# EAGLE design ctia (EAGLE 7.2.0)
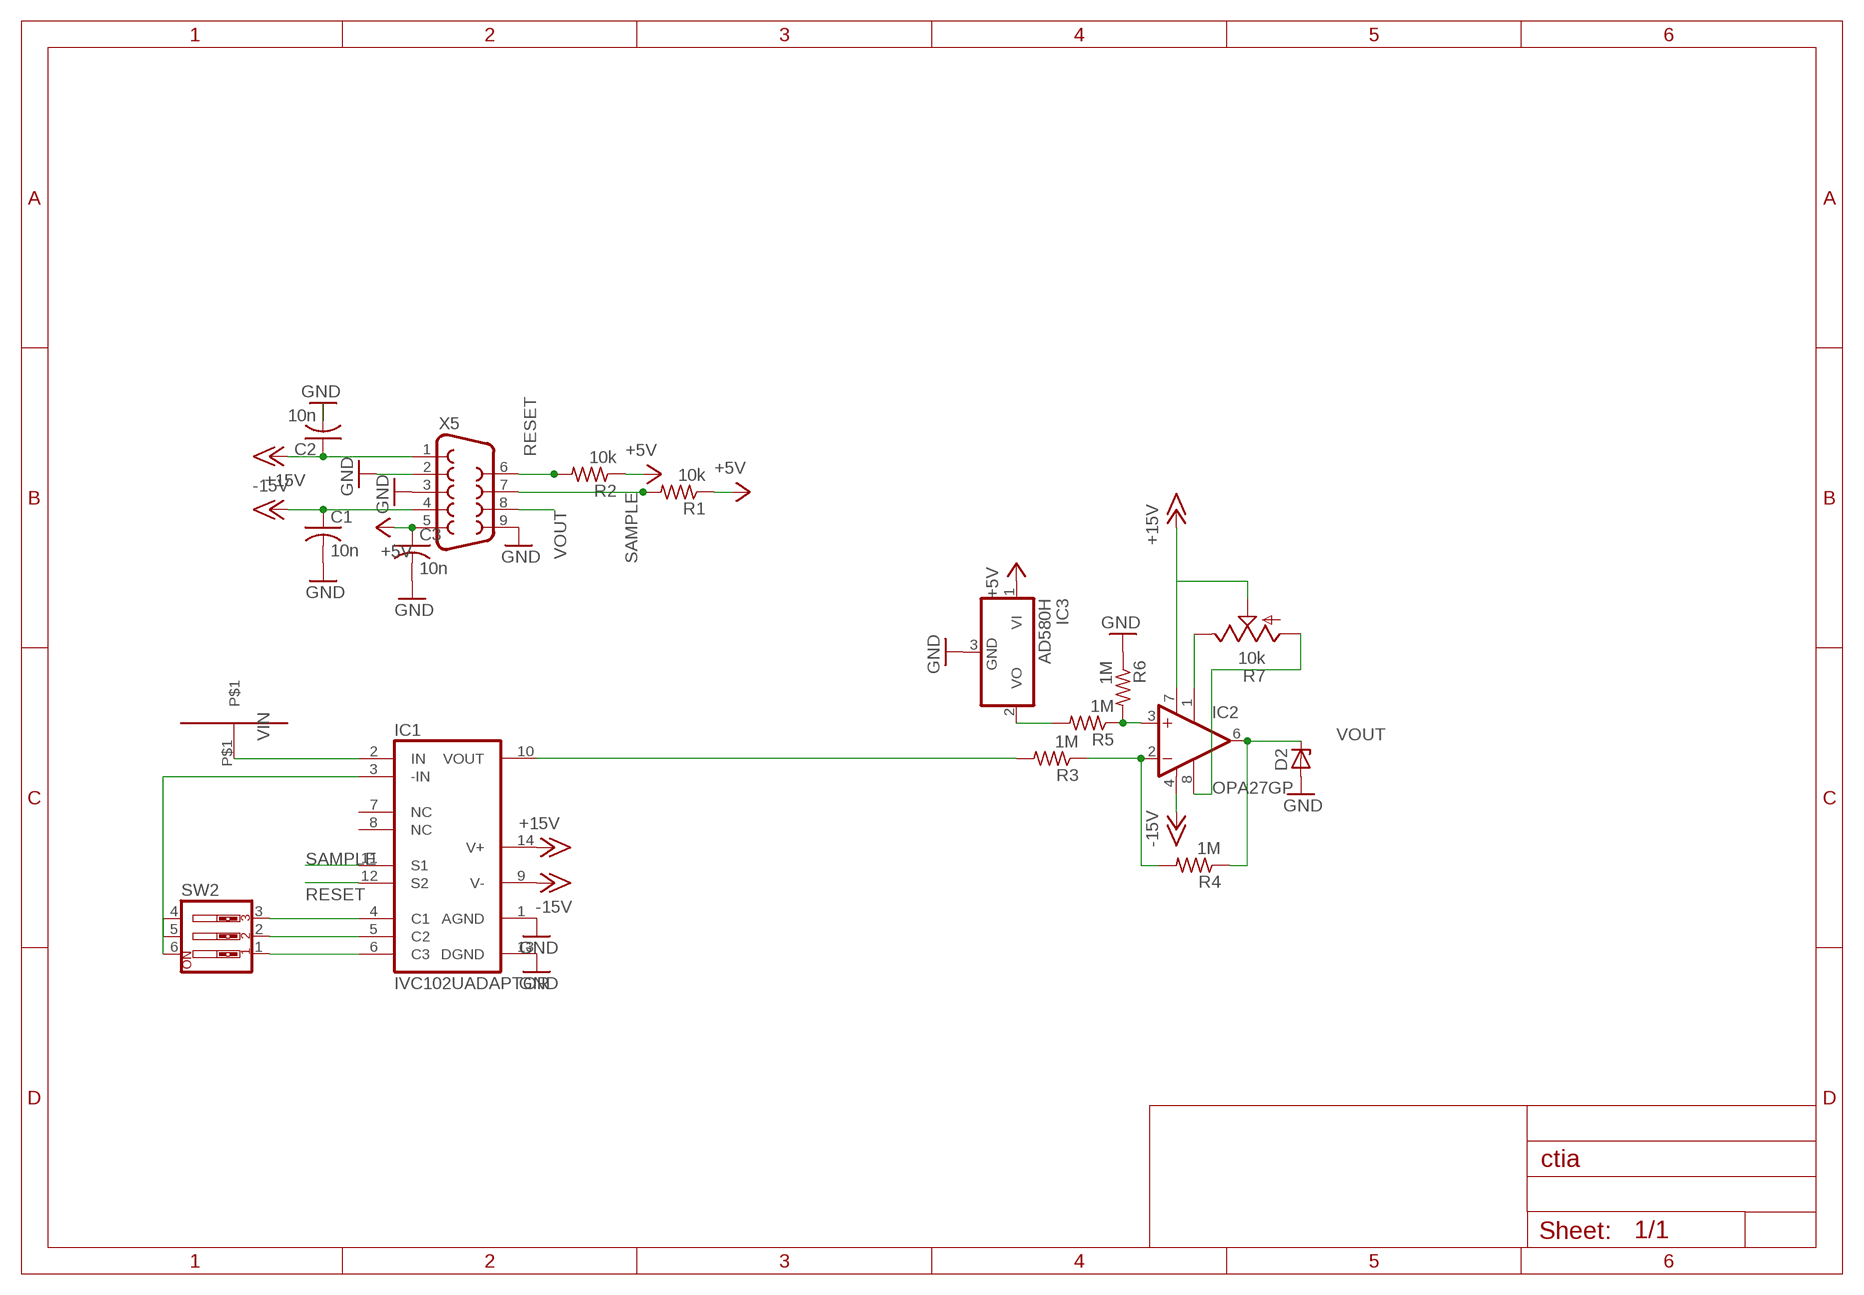
[diagram p0: schematic, sheet 1]

## Parts
C1  10n  C-US050-050X075  [C050-050X075]
C2  10n  C-US050-050X075  [C050-050X075]
C3  10n  C-US050-050X075  [C050-050X075]
D2  ZENER-DIODEDO41Z10  [DO41Z10]
IC1  IVC102UADAPTOR  [DIL14]
IC2  OPA27GP  [DIL08]
IC3  AD580H  [TO39]
R1  10k  R-US_0207/15  [0207/15]
R2  10k  R-US_0207/15  [0207/15]
R3  1M  R-US_0207/10  [0207/10]
R4  1M  R-US_0207/10  [0207/10]
R5  1M  R-US_0207/10  [0207/10]
R6  1M  R-US_0207/10  [0207/10]
R7  10k  TRIM_US-B64Y  [B64Y]
SW2  SW_DIP-3  [EDG-03]
U$1  CTIA  [CTIA]
X5  F09HP  [F09HP]

## Nets
+5V: C3.1 IC3.1(VI) R1.1 R2.1 X5.5
+15V: C2.1 IC1.14(V+) IC2.7(V+) R7.S X5.1
-15V: C1.1 IC1.9(V-) IC2.4(V-) X5.4
GND: C1.2 C2.2 C3.2 D2.A IC1.1(AGND) IC1.13(DGND) IC3.3(GND) R6.1 X5.2 X5.3 X5.9
N$1: IC1.6(C3) SW2.1
N$2: IC1.5(C2) SW2.2
N$3: IC1.4(C1) SW2.3
N$4: IC1.3(-IN) SW2.4 SW2.5 SW2.6
N$5: IC1.10(VOUT) R3.2
N$6: IC2.2(-IN) R3.1 R4.2
N$7: IC2.3(+IN) R5.1 R6.2
N$8: IC3.2(VO) R5.2
N$9: IC2.1(OFF1) R7.E
N$10: IC2.8(OFF2) R7.A
RESET: IC1.12(S2) R2.2 X5.6
SAMPLE: IC1.11(S1) R1.2 X5.7
VIN: IC1.2(IN) U$1.P$1
VOUT: D2.C IC2.6(OUT) R4.1 X5.8
Unconnected: IC1.7(NC) IC1.8(NC)

## Library data of the parts
C1-C3 = rcl:C-US: CAPACITOR, American symbol
D2 = diode:ZENER-DIODE: Z-Diode
IC1 = burr-brown:IVC102U: Amplifier Precision Switched Integrator Transimpedance
IC2 = linear:OPA*?: Ultra-Low Noise, Precision OP AMP Source: http://focus.ti.com/lit/ds/symlink/opa27.pdf http://focus.ti.com .. opa241.pdf
IC3 = linear:AD580H: VOLTAGE REFERENCE 2.5 V
R1-R6 = resistor:R-US_: RESISTOR, American symbol
R7 = pot:TRIM_US-: POTENTIOMETER
SW2 = special:SW_DIP-3: DIP SWITCH
U$1 = ctia:CTIA
X5 = con-subd:F09: SUB-D; OC_FARNELL: unknown; OC_NEWARK: unknown

## Board
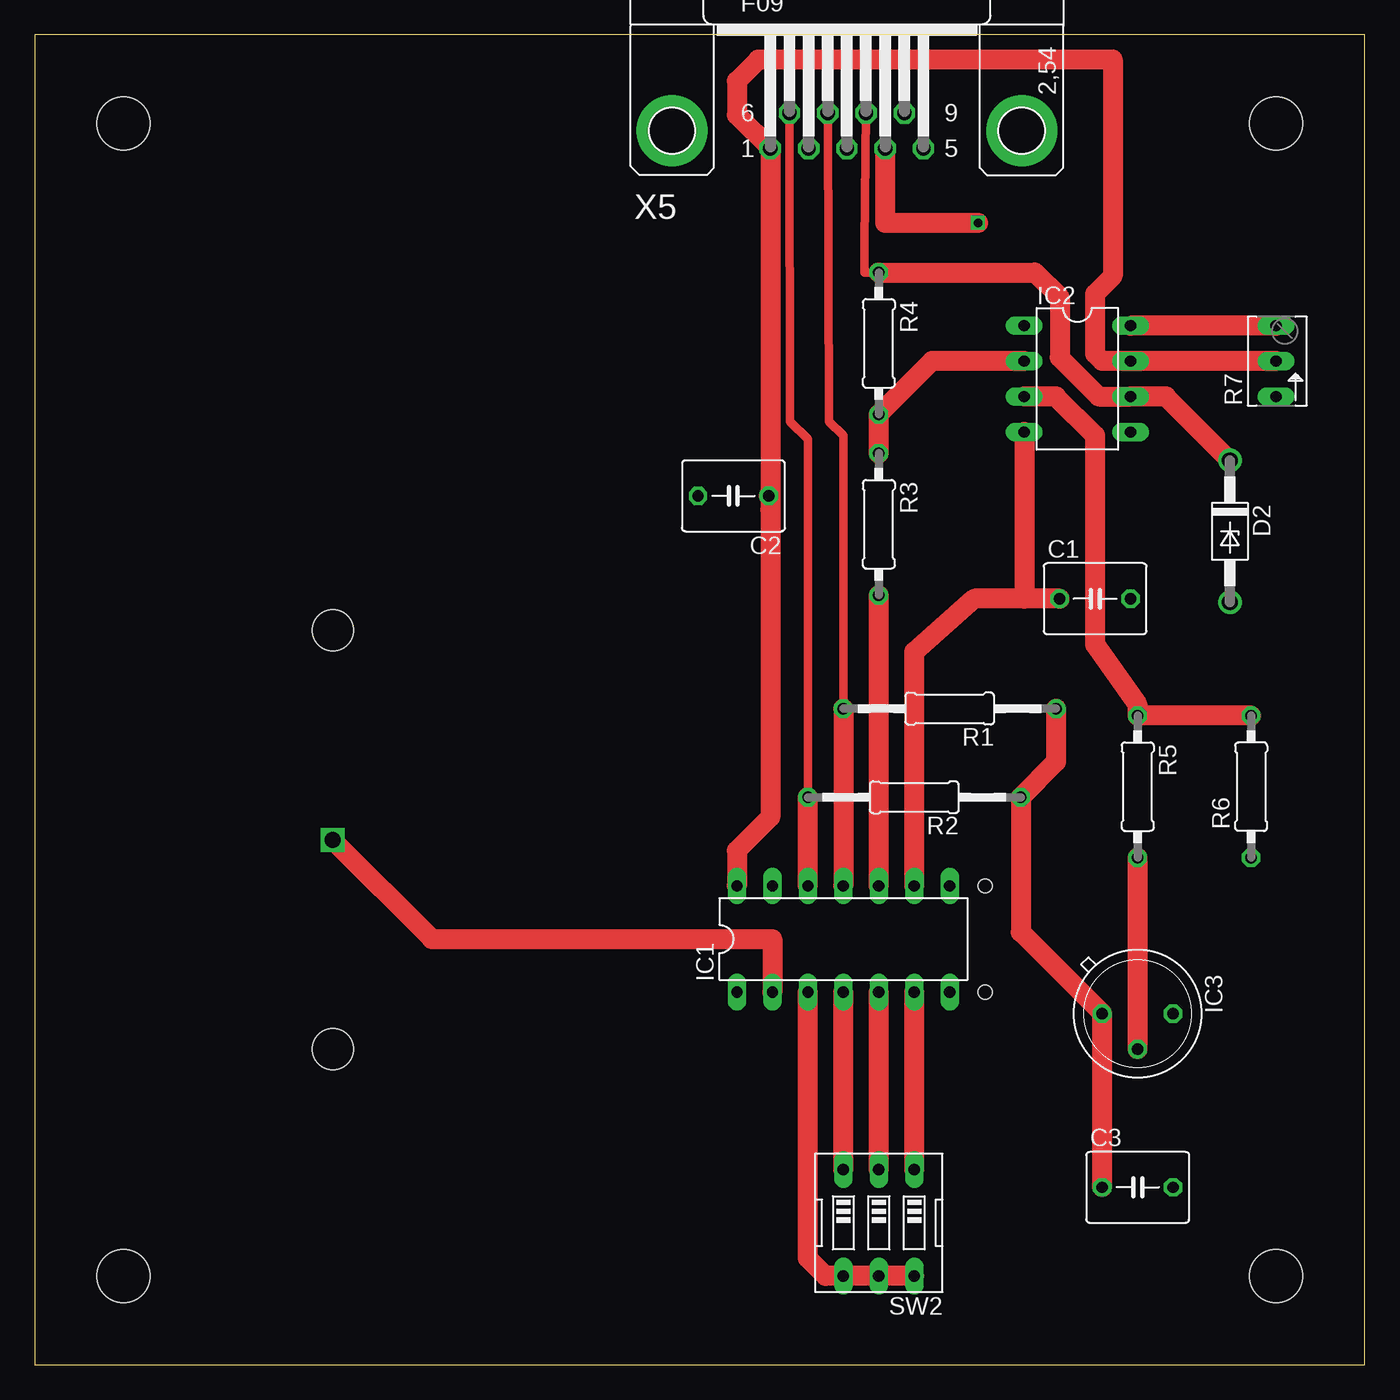
[diagram p1: board, top side]
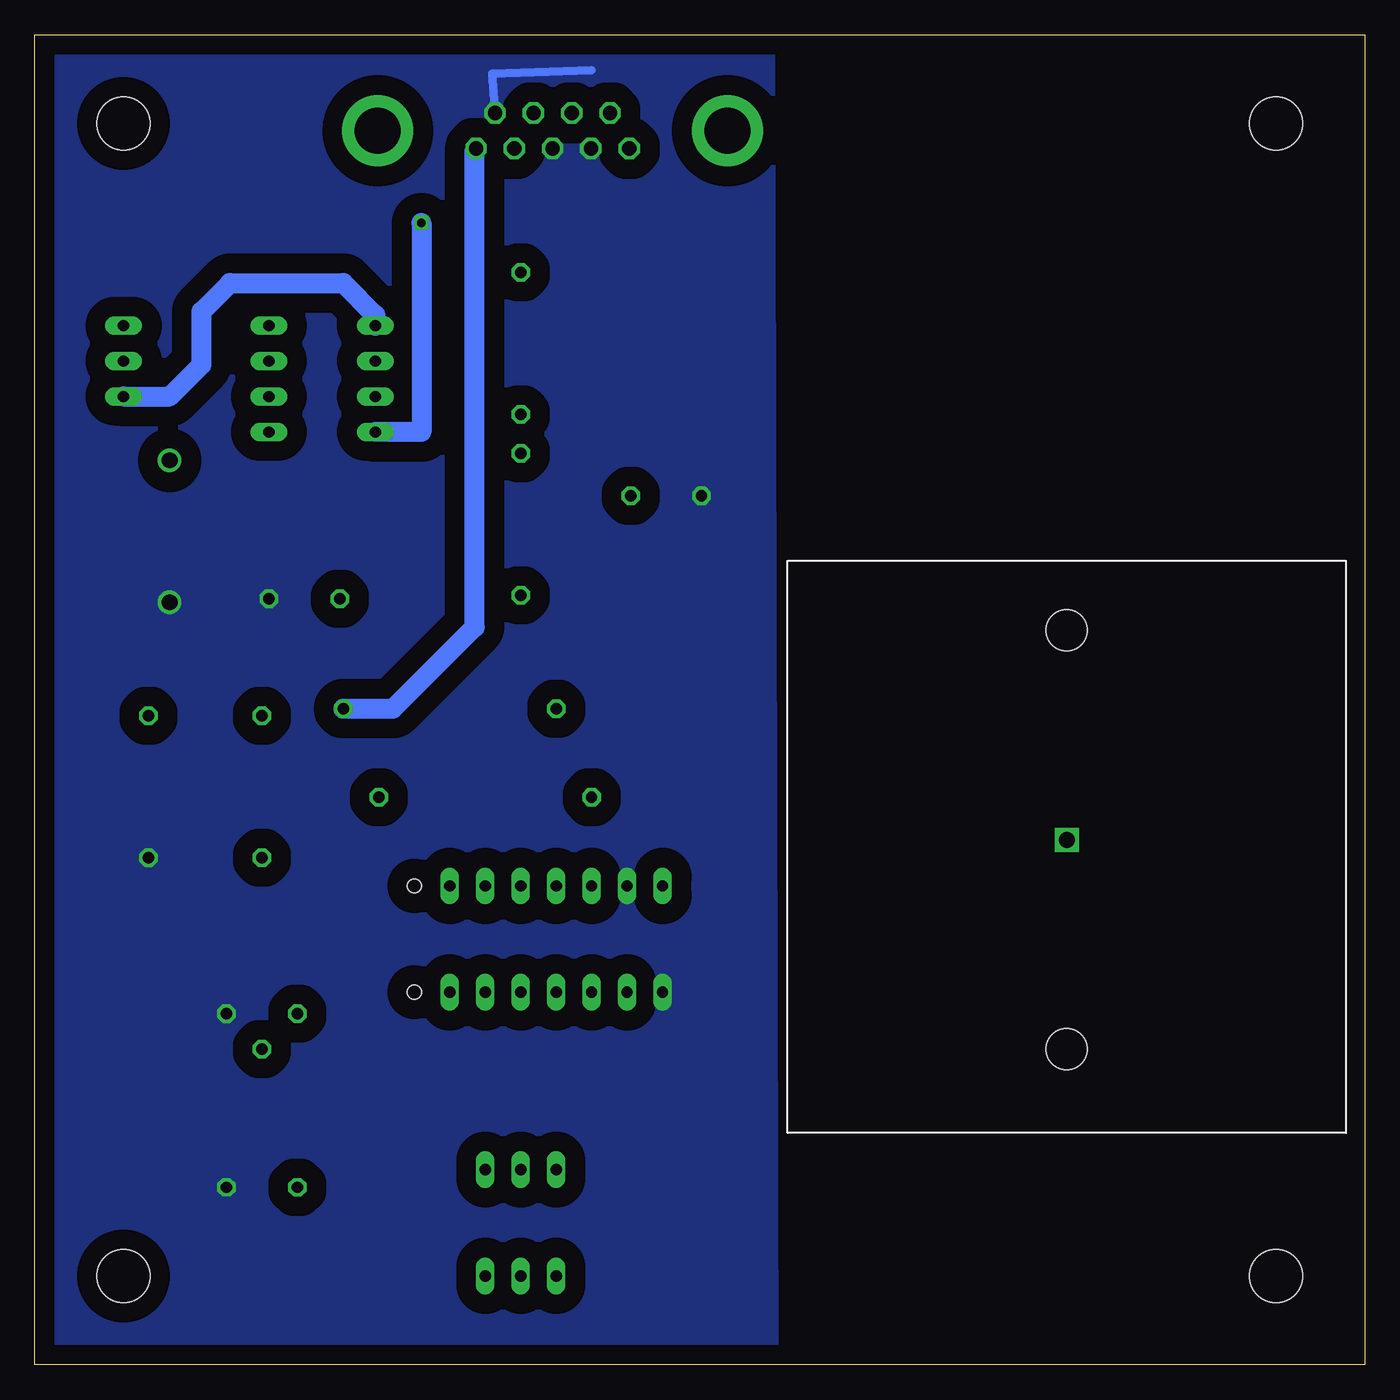
[diagram p2: board, bottom side, seen from below]

Size 95.25 x 95.25 mm. Coordinates in mm from the lower left corner, seen from the top.
Outline: 0,0 95.25,0 95.25,95.25 0,95.25 0,0
Copper layers (1*16): Top 0.035mm / dielectric 1.5mm / Bottom 0.035mm
Design rules "default": minimum track width 10mil, minimum drill 24mil, track to track 8mil, track to pad 8mil, pad to pad 8mil, via to via 8mil, smd to smd 8mil, copper to edge 40mil, drill to drill 8mil, minimum pad ring 10mil, minimum via ring 8mil, stop-mask expansion 4mil, vias tented up to drill 0mil, thermal gap 10mil
Holes 1 mm at 68.07,34.29 68.07,26.67
Holes 3.8 mm at 6.35,88.9 88.9,88.9 88.9,6.35 6.35,6.35

### Footprints (pad centres in the part's own frame; a part is rotated, then mirrored left to right if it is on the bottom)
C050-050X075 = drill 0.813 octagon: 1 -2.54,0; 2 2.54,0
DO41Z10 = drill 1.118: A 5.08,0; C -5.08,0
DIL14 = drill 0.813 long: 1 -7.62,-3.81; 2 -5.08,-3.81; 3 -2.54,-3.81; 4 0,-3.81; 5 2.54,-3.81; 6 5.08,-3.81; 7 7.62,-3.81; 8 7.62,3.81; 9 5.08,3.81; 10 2.54,3.81; 11 0,3.81; 12 -2.54,3.81; 13 -5.08,3.81; 14 -7.62,3.81
DIL08 = drill 0.813 long: 1 -3.81,-3.81; 2 -1.27,-3.81; 3 1.27,-3.81; 4 3.81,-3.81; 5 3.81,3.81; 6 1.27,3.81; 7 -1.27,3.81; 8 -3.81,3.81
TO39 = drill 0.813 octagon: 1 0,-2.54; 2 2.54,0; 3 0,2.54
0207/15 = drill 0.813 octagon: 1 -7.62,0; 2 7.62,0
0207/10 = drill 0.813 octagon: 1 -5.08,0; 2 5.08,0
B64Y = drill 0.813 long: A 2.54,0; E -2.54,0; S 0,0
EDG-03 = drill 0.813 long: 1 -2.54,-3.81; 2 0,-3.81; 3 2.54,-3.81; 4 2.54,3.81; 5 0,3.81; 6 -2.54,3.81
CTIA = drill 1.143 square: P$1 0,0 | hole 2.946: 14.999,0; -14.999,0
F09HP = drill 1.016 octagon: 1 -5.486,-1.27; 2 -2.743,-1.27; 3 0,-1.27; 4 2.743,-1.27; 5 5.486,-1.27; 6 -4.115,1.27; 7 -1.372,1.27; 8 1.372,1.27; 9 4.115,1.27 | drill 3.302 pad 5.08: G1 -12.522,0; G2 12.522,0

### Placement (x,y rotation side)
C1  75.95,54.86 0 top
C2  50.04,62.23 180 top
C3  78.99,12.7 0 top
D2  85.6,59.69 270 top
IC1  57.91,30.48 0 top
IC2  74.68,70.61 270 top
IC3  78.99,25.15 270 top
R1  65.53,46.99 180 top
R2  62.99,40.64 180 top
R3  60.45,60.2 270 top
R4  60.45,73.15 270 top
R5  78.99,41.4 270 top
R6  87.12,41.4 90 top
R7  88.9,71.88 90 top
SW2  60.45,10.16 180 top
U$1  21.34,37.59 90 bottom
X5  58.17,88.39 0 top

### Tracks (layer width: path | path; a pad name or v marks a point on that pad's centre or on a via)
+5V
  Top 1.422: R1.1 73.15,43.18 R2.1 70.61,30.99 IC3.1 C3.1
  Bottom 1.422: R1.1 69.6,46.99 63.75,52.83 63.75,87.02 X5.5
+15V
  Top 1.422: 52.68,62.23 X5.1 50.29,89.51 50.29,91.95 51.82,93.47 77.22,93.47 77.22,77.98 75.95,76.71 75.95,72.39 76.45,71.88 IC2.7 R7.S | IC1.14 50.29,36.83 52.68,39.22 52.68,61.21 52.68,62.23 | C2.1 52.68,62.23
-15V  (via drill 0.6)
  Top 1.422: IC1.9 62.99,51.05 67.31,54.86 70.87,54.86 | IC2.4 70.87,54.86 | C1.1 70.87,54.86 | v67.56,81.79 60.91,81.79 X5.4
  Bottom 1.422: v67.56,81.79 67.56,66.8 IC2.4
GND
  Bottom 0.61: 55.37,92.71 62.48,92.46 X5.9
  pour Bottom (isolate 1.422, no thermals): 42.42,95 95.5,95.25 95.25,0 42.16,0
N$1
  Top 1.422: SW2.1 IC1.6
N$2
  Top 1.422: SW2.2 IC1.5
N$3
  Top 1.422: SW2.3 IC1.4
N$4
  Top 1.422: SW2.6 SW2.5 SW2.4 56.64,6.35 55.37,7.62 IC1.3
N$5
  Top 1.422: IC1.10 R3.2
N$6
  Top 1.422: R3.1 R4.2 64.26,71.88 IC2.2
N$7
  Top 1.422: R6.2 R5.1 78.99,47.24 75.95,51.56 75.95,66.55 73.15,69.34 IC2.3
N$8
  Top 1.422: IC3.2 R5.2
N$9
  Bottom 1.422: R7.E 85.6,69.34 83.31,71.63 83.31,75.44 81.28,77.47 73.15,77.47 70.87,75.18 IC2.1
N$10
  Top 1.422: R7.A IC2.8
RESET
  Top 0.61: X5.6 54.1,67.56 55.37,66.29 R2.2
  Top 1.422: IC1.12 R2.2
SAMPLE
  Top 0.61: R1.2 57.91,66.55 56.9,67.56 X5.7
  Top 1.422: R1.2 IC1.11
VIN
  Top 1.422: U$1.P$1 28.45,30.48 52.83,30.48 IC1.2
VOUT
  Top 0.61: X5.8 59.44,80.26 59.44,78.23 R4.1
  Top 1.422: D2.C 81.03,69.34 IC2.6 76.2,69.34 73.41,72.14 73.41,76.45 71.63,78.23 R4.1